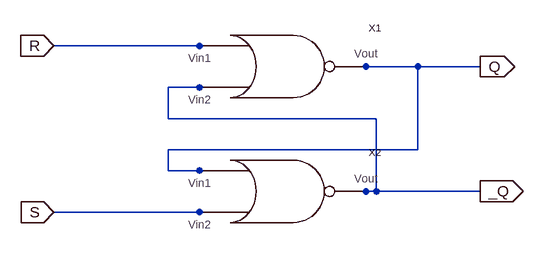
[diagram p0: schematic SRlatch.asc]
SRlatch.asc, the LTspice schematic file:
Version 4
SHEET 1 880 680
WIRE 112 64 -144 64
WIRE 416 96 304 96
WIRE 512 96 416 96
WIRE 112 128 32 128
WIRE 32 176 32 128
WIRE 352 176 32 176
WIRE 416 224 416 96
WIRE 416 224 32 224
WIRE 32 256 32 224
WIRE 112 256 32 256
WIRE 352 288 352 176
WIRE 352 288 304 288
WIRE 512 288 352 288
WIRE 112 320 -144 320
FLAG -144 64 R
IOPIN -144 64 In
FLAG -144 320 S
IOPIN -144 320 In
FLAG 512 96 Q
IOPIN 512 96 Out
FLAG 512 288 _Q
IOPIN 512 288 Out
SYMBOL nor_2 128 96 R0
SYMATTR InstName X1
SYMBOL nor_2 128 288 R0
SYMATTR InstName X2

The netlist it stands for:
* SRlatch.asc
XX1 R _Q Q nor_2  ; pins Vin1 Vin2 Vout
XX2 Q S _Q nor_2  ; pins Vin1 Vin2 Vout
.backanno
.end